# Altium project Wireless_Security_Detector.PrjPcb
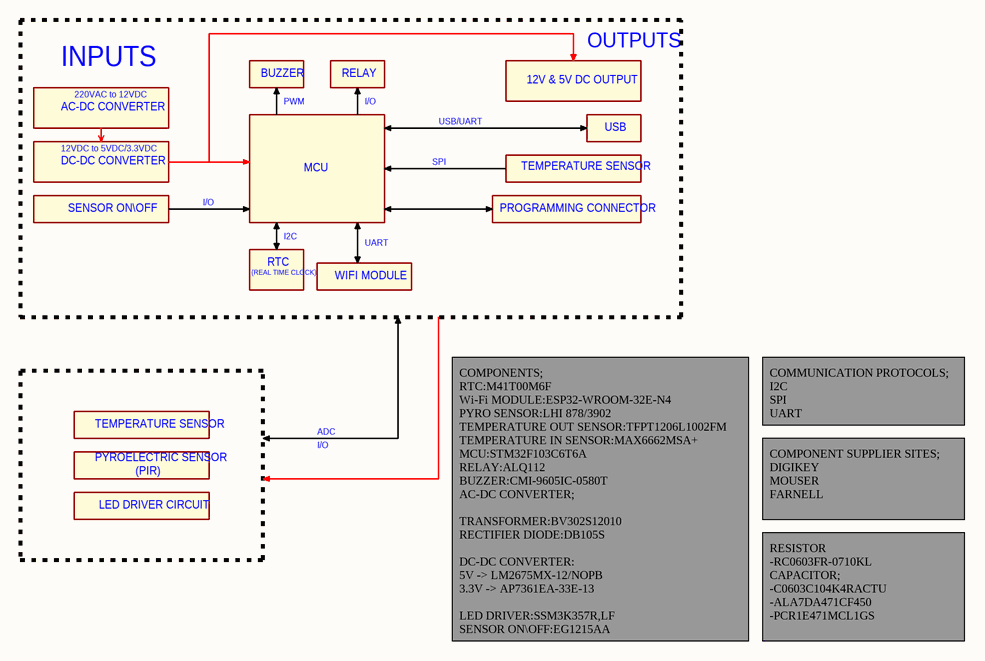
[diagram p0: Block_Diagram.SchDoc]
5 sheets, 126 parts. Net scope: global (net labels, ports and power ports of the same name join across sheets).
Board file: Wireless_Security_Detector.PcbDoc
Sheets:
  Wireless_Security_Detector.SchDoc
  Block_Diagram.SchDoc
  Power_Management.SchDoc
  Microcontroller.SchDoc
  Sensor_Board.SchDoc

## Sheet Wireless_Security_Detector.SchDoc
size A3; Date: 29/01/2025; Engineer: Emirhan BOZKURT; SheetNumber: 1; SheetTotal: 5; PageSize: A3; Position: R&D Electronics Engineer

### Notes on the sheet
- Document Name:
- Designed By:
- Department:
- Project Name:
- Sheet Number:
- Size:
- Date:

## Sheet Block_Diagram.SchDoc
size A3; Date: 29/01/2025; Engineer: Emirhan BOZKURT; SheetNumber: 2; SheetTotal: 5; PageSize: A3; Position: R&D Electronics Engineer

### Notes on the sheet
- INPUTS
- BUZZER
- RELAY
- OUTPUTS
- AC-DC CONVERTER
- 12VDC to 5VDC/3.3VDC
- 220VAC to 12VDC
- PWM
- I/O
- USB/UART
- 12V & 5V DC OUTPUT
- USB
- DC-DC CONVERTER
- SENSOR ON\OFF
- MCU
- SPI
- PROGRAMMING CONNECTOR
- TEMPERATURE SENSOR
- (REAL TIME CLOCK)
- RTC
- I2C
- WIFI MODULE
- UART
- COMMUNICATION PROTOCOLS;
  I2C
  SPI
  UART
- PYROELECTRIC SENSOR
- (PIR)
- ADC
- LED DRIVER CIRCUIT
- COMPONENT SUPPLIER SITES;
  DIGIKEY
  MOUSER
  FARNELL
- COMPONENTS;
  RTC:M41T00M6F
  Wi-Fi MODULE:ESP32-WROOM-32E-N4
  PYRO SENSOR:LHI 878/3902
  TEMPERATURE OUT SENSOR:TFPT1206L1002FM
  TEMPERATURE IN SENSOR:MAX6662MSA+
  MCU:STM32F103C6T6A
  RELAY:ALQ112
  BUZZER:CMI-9605IC-0580T
  AC-DC CONVERTER;
  TRANSFORMER:BV302S12010
  RECTIFIER DIODE:DB105S
  DC-DC CONVERTER:
  5V -> LM2675MX-12/NOPB
  3.3V -> AP7361EA-33E-13
  LED DRIVER:SSM3K357R,LF
  SENSOR ON\OFF:EG1215AA
- RESISTOR
  -RC0603FR-0710KL
  CAPACITOR;
  -C0603C104K4RACTU
  -ALA7DA471CF450
  -PCR1E471MCL1GS
- Document Name:
- Designed By:
- Department:
- Project Name:
- Sheet Number:
- Size:
- Date:

## Sheet Power_Management.SchDoc
size A3; Date: 29/01/2025; Engineer: Emirhan BOZKURT; SheetNumber: 3; SheetTotal: 5; PageSize: A3; Position: R&D Electronics Engineer
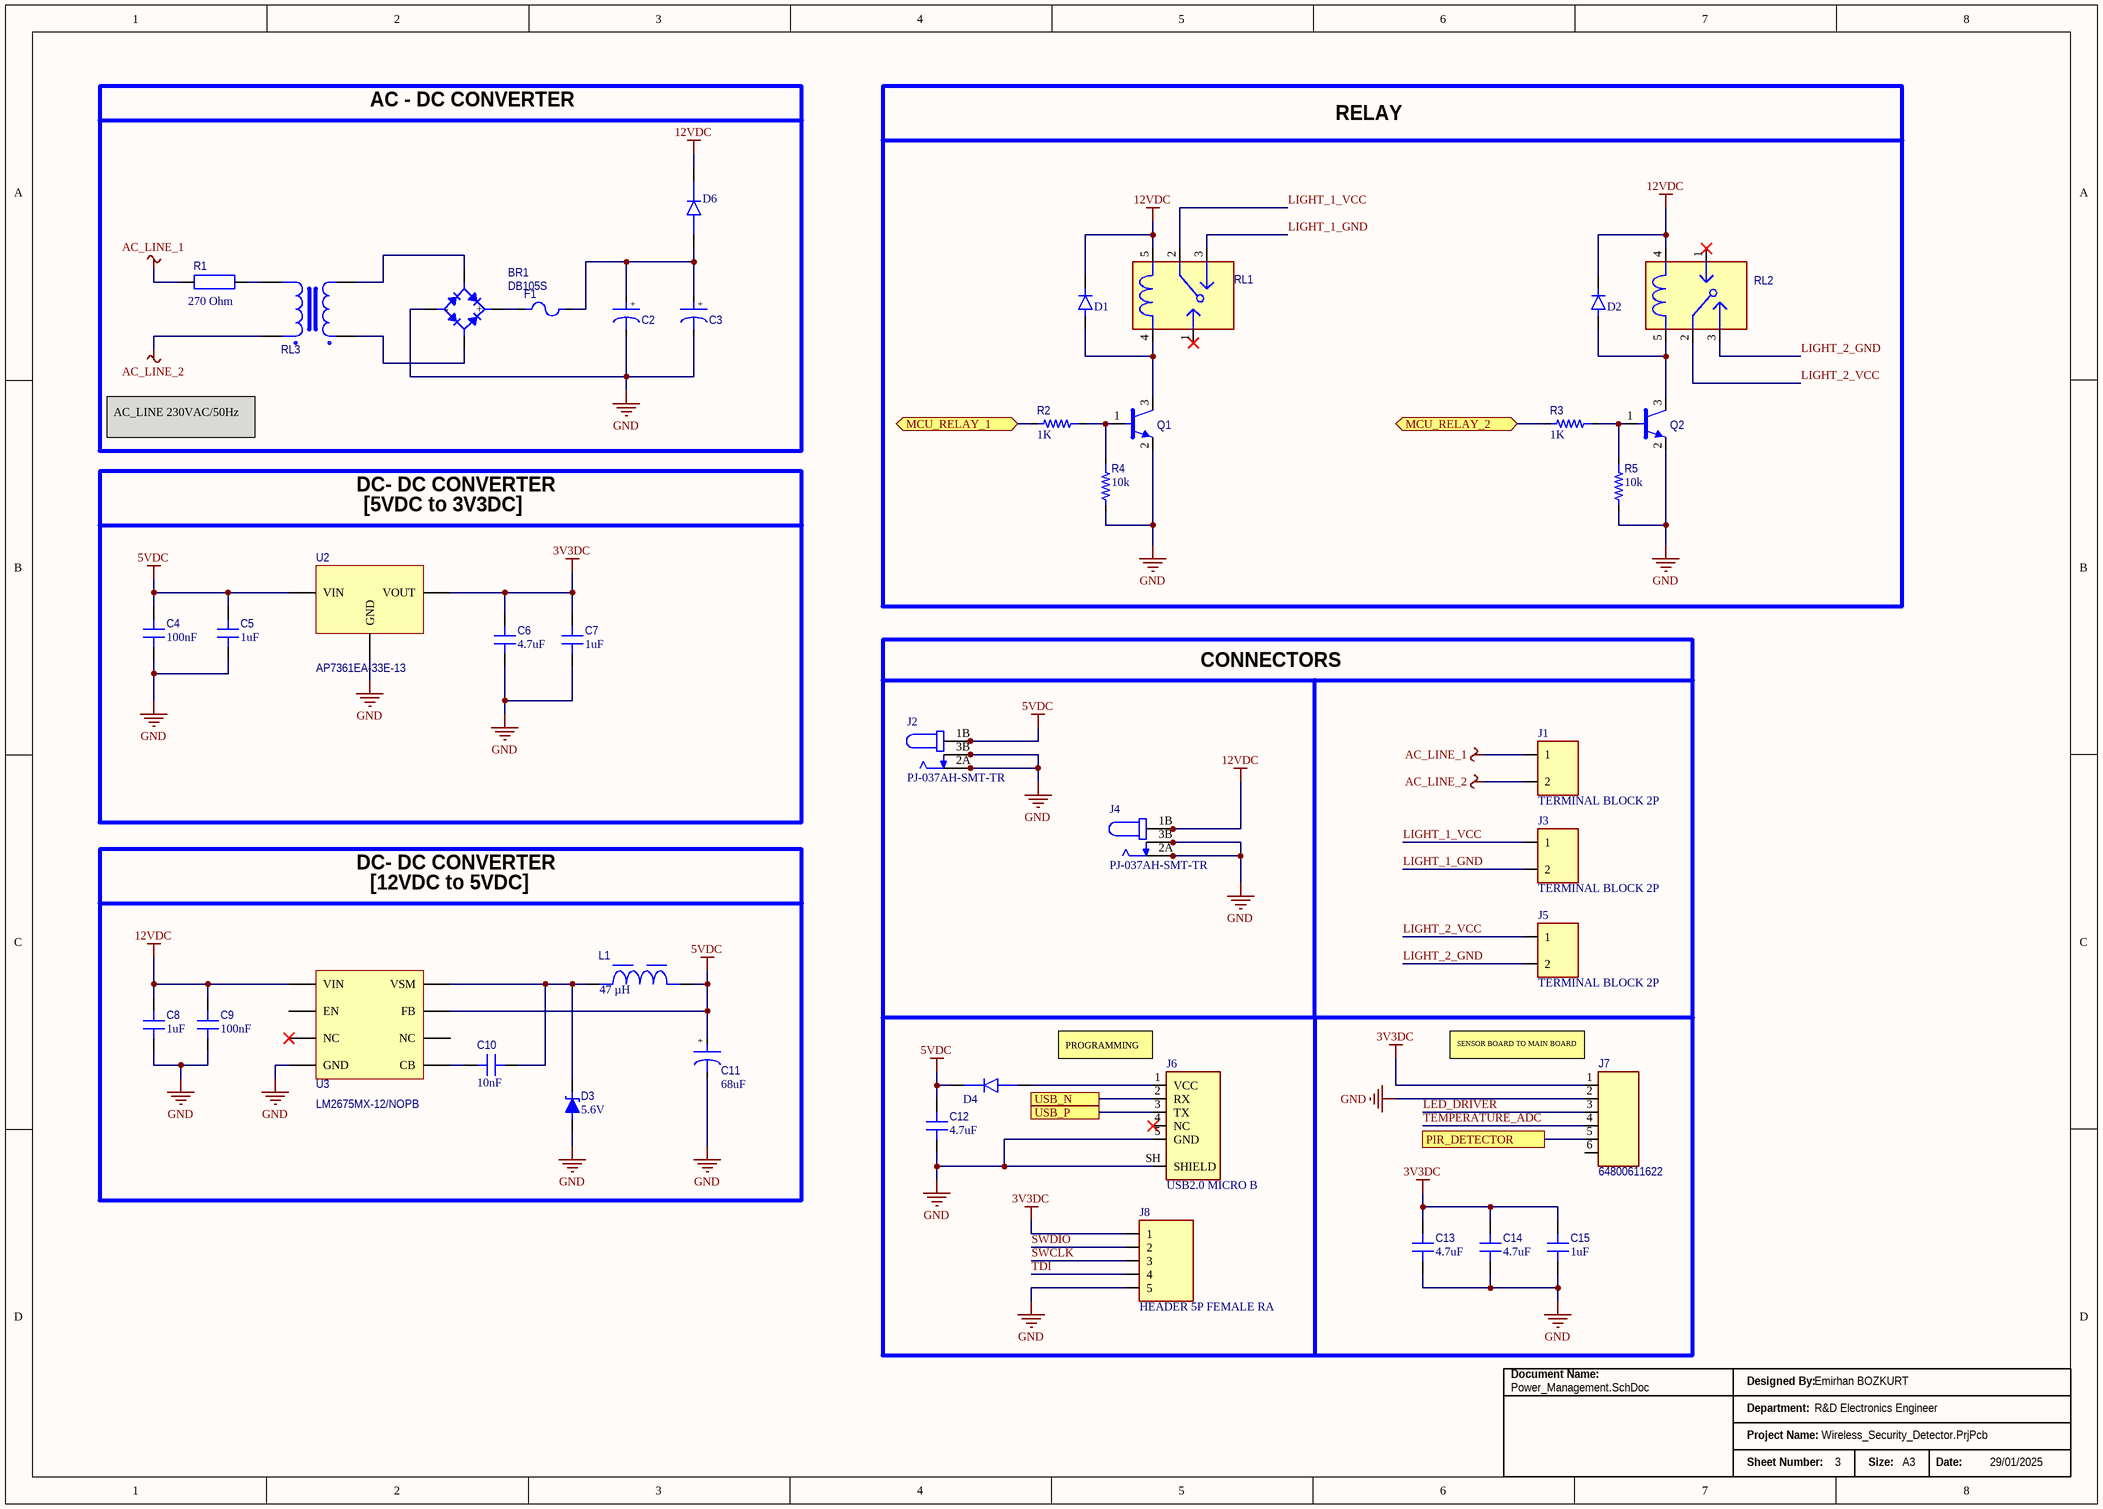
[diagram p1: Power_Management.SchDoc]

### Parts
BR1  DB105S  [DB105S]
C2  ESH477M035AH3AA  [ESH477M035AH3AA]  (value not drawn)
C3  ESH477M035AH3AA  [ESH477M035AH3AA]  (value not drawn)
C4  value 100nF  [CAP_0805]  (hidden comment: 1276-1003-2-ND)
C5  value 1uF  [CAP_0805]  (hidden comment: CL21B105KBFNNNE)
C6  value 4.7uF  [CAP_0805]  (hidden comment: CL21A475KAQNNNE)
C7  value 1uF  [CAP_0805]  (hidden comment: CL21B105KBFNNNE)
C8  value 1uF  [CAP_0805]  (hidden comment: CL21B105KBFNNNE)
C9  value 100nF  [CAP_0805]  (hidden comment: 1276-1003-2-ND)
C10  value 10nF  [CAP_0603]  (hidden comment: CL10B102KB8NNNC)
C11  value 68uF  [CAP_ALU_68uF]  (hidden comment: EEV686M035A9HAA)
C12  value 4.7uF  [CAP_0805]  (hidden comment: CL21A475KAQNNNE)
C13  value 4.7uF  [CAP_0805]  (hidden comment: CL21A475KAQNNNE)
C14  value 4.7uF  [CAP_0805]  (hidden comment: CL21A475KAQNNNE)
C15  value 1uF  [CAP_0805]  (hidden comment: CL21B105KBFNNNE)
D1  1N4148WS  [1N4148WS]  (value not drawn)
D2  1N4148WS  [1N4148WS]  (value not drawn)
D3  value 5.6V  [1SMB5919BT3G]  (hidden comment: 1SMB5919BT3G)
D4  1N4148WS  [1N4148WS]  (value not drawn)
D6  1N4148WS  [1N4148WS]  (value not drawn)
F1  3413.0216.22  [FUSE 1A]  (value not drawn)
J1  TERMINAL BLOCK 2P  [TBP01R1-508]
J2  PJ-037AH-SMT-TR  [PJ-037AH-SMT-TR]
J3  TERMINAL BLOCK 2P  [TBP01R1-508]
J4  PJ-037AH-SMT-TR  [PJ-037AH-SMT-TR]
J5  TERMINAL BLOCK 2P  [TBP01R1-508]
J6  USB2.0 MICRO B  [USB2.0 MICRO B]
J7  64800611622  [64800611622]
J8  HEADER 5P FEMALE RA  [HDR_5_POS_CONN_RA]
L1  value 47 µH  [INT_47uL]  (hidden comment: 78438335470)
Q1  MMBT3904-7-F  [SOT-23F]  (value not drawn)
Q2  MMBT3904-7-F  [SOT-23F]  (value not drawn)
R1  value 270 Ohm  [RES_AXIAL_W]  (hidden comment: 5WD27)
R2  value 1K  [RES_0603]  (hidden comment: RC0603FR-071KL)
R3  value 1K  [RES_0603]  (hidden comment: RC0603FR-071KL)
R4  value 10k  [RES_0603]  (hidden comment: RC0603FR-0710KL)
R5  value 10k  [RES_0603]  (hidden comment: RC0603FR-0710KL)
RL1  ALQ112  [ALQ112]  (value not drawn)
RL2  ALQ112  [ALQ112]  (value not drawn)
RL3  BV302S12010  [BV302S12010]  (value not drawn)
U2  AP7361EA-33E-13  [AP7361EA-33E-13]
U3  LM2675MX-12/NOPB  [LM2675MX-12/NOPB]

### Blocks framed on the sheet
AC - DC CONVERTER: BR1 C2 C3 D6 F1 R1 RL3
RELAY: D1 D2 Q1 Q2 R2-R5 RL1 RL2
CONNECTORS: C12-C15 D4 J1-J8

### Ports
MCU_RELAY_1 (bidir), MCU_RELAY_2 (bidir), PIR_DETECTOR, USB_N, USB_P

### Nets
3V3DC: C6.2 C7.2 C13.2 C14.2 C15.2 J7.1 J8.1 U2.3(VOUT)
5VDC: C4.2 C5.2 C11.1(A) C12.2 D4.C J2.1A J2.1B L1.2 U2.1(VIN) U3.4(FB)
12VDC: C8.2 C9.2 D1.C D2.C D6.C J4.1A J4.1B RL1.5 RL2.4 U3.7(VIN)
AC_LINE_1: J1.1 R1.1
AC_LINE_2: J1.2 RL3.1
GND: BR1.4(-) C2.2(K) C3.2(K) C4.1 C5.1 C6.1 C7.1 C8.1 C9.1 C11.2(K) C12.1 C13.1 C14.1 C15.1 D3.1 J2.2A J2.2B J2.3A J2.3B J4.2A J4.2B J4.3A J4.3B J6.5(GND) J6.SH(SHIELD) J7.2 J8.5 Q1.2(E) Q2.2(E) R4.1 R5.1 U2.2(GND) U3.6(GND)
LED_DRIVER: J7.3
LIGHT_1_GND: J3.2 RL1.3(NO)
LIGHT_1_VCC: J3.1 RL1.2(NC)
LIGHT_2_GND: J5.2 RL2.3(NO)
LIGHT_2_VCC: J5.1 RL2.2(NC)
SWCLK: J8.3
SWDIO: J8.2
TDI: J8.4
TEMPERATURE_ADC: J7.4
USB_N: J6.2(RX) ; port USB_N
USB_P: J6.3(TX) ; port USB_P
NetBR1_1: BR1.1 RL3.9
NetBR1_2: BR1.2 RL3.7
NetBR1_3: BR1.3(+) F1.1
NetC2_1: C2.1(A) C3.1(A) D6.A F1.2
NetC10_1: C10.1 U3.1(CB)
NetC10_2: C10.2 D3.2 L1.1 U3.8(VSM)
NetD1_A: D1.A Q1.3(C) RL1.4
NetD2_A: D2.A Q2.3(C) RL2.5
NetD4_A: D4.A J6.1(VCC)
NetJ7_5: J7.5 ; port PIR_DETECTOR
NetQ1_1: Q1.1(B) R2.2 R4.2
NetQ2_1: Q2.1(B) R3.2 R5.2
NetR1_2: R1.2 RL3.5
NetR2_1: R2.1 ; port MCU_RELAY_1
NetR3_1: R3.1 ; port MCU_RELAY_2

Not connected (* = marked no-connect by the designer): J6 4(NC)*; J7 6; RL1 1(COM)*; RL2 1(COM)*; U3 2(NC)* 3(NC) 5(EN)

### Notes on the sheet
- AC_LINE 230VAC/50Hz
- DC- DC CONVERTER
- [5VDC to 3V3DC]
- 5VDC OUTPUT
- AC INPUT CONNECTOR
- 12VDC OUTPUT
- [12VDC to 5VDC]
- (near J3) LED 1 OUTPUT
- (near J5) LED 2 OUTPUT
- PROGRAMMING
- (near J7) SENSOR BOARD TO MAIN BOARD
- Document Name:
- Designed By:
- Department:
- Project Name:
- Sheet Number:
- Size:
- Date:
- (in symbol CAP ALU 68uF SMD) +
- (in symbol CAP ALU 470uF TH) +

### Library data of the parts
BR1 = DB105S: BRIDGE RECT 1PHASE 600V 1A DB-S; Designed By: Emirhan Bozkurt; Supplier Part Number: 1655-DB105STR-ND; Supplier 1: DigiKey; Max Supply Voltage: 600V; Current: 1A; Mounting Type: Surface Mount; Case Package: DB-S
C2 C3 = CAP ALU 470uF TH: CAP ALUM 470UF 20% 35V RADIAL TH; Manufacturer: KEMET; Manufacturer Product Number: ALA7DA471CF450; Designed By: Emirhan Bozkurt; Value: 470uF; Supplier Part Number: 399-6592-ND; Supplier 1: DigiKey; Category: Aluminum Electrolytic Capacitors; Mounting Type: TH; Size: 10mm
C4 C9 = CAP CER 100nF 0805: CAP CER 0.1uF 50V X7R 0805; Designed By: Emirhan Bozkurt; Supplier Part Number: 1276-1003-2-ND; Supplier 1: DigiKey; Case Package: 0805; Mounting Type: Surface Mount; Manufacturer Product Number: 1276-1003-2-ND
C5 C7 C8 C15 = CAP CER 1uF 0805: CAP CER 1uF 25V X5R 0805; Manufacturer: Samsung Electro-Mechanics; Designed By: Emirhan Bozkurt; Supplier Part Number: 1276-1029-1-ND; Supplier 1: DigiKey; Case Package: 0805; Mounting Type: Surface Mount
  C15: Manufacturer Product Number: CL21B105KBFNNNE
C6 C12-C14 = CAP CER 4.7uF 0805: CAP CER 4.7uF 25V X5R 0805; Manufacturer: Samsung Electro-Mechanics; Designed By: Emirhan Bozkurt; Supplier Part Number: CL21A475KAQNNNE; Supplier 1: DigiKey; Case Package: 0805; Mounting Type: Surface Mount; Manufacturer Product Number: CL21A475KAQNNNE
C10 = CAP CER 10nF 0603: CAP CER 1000pF 50V X7R 0603; Manufacturer: Samsung Electro-Mechanics; Designed By: Emirhan Bozkurt; Supplier Part Number: 1276-1018-1-ND; Supplier 1: DigiKey; Case Package: 0603; Mounting Type: Surface Mount
C11 = CAP ALU 68uF SMD: CAP ALUM 68uF 20% 35V SMD; Manufacturer: KEMET; Designed By: Emirhan Bozkurt; Supplier Part Number: 399-6722-1-ND; Supplier 1: DigiKey; Case Package: 0603; Category: Aluminum Electrolytic Capacitors; Mounting Type: Surface Mount
D1 D2 D4 D6 = 1N4148WS: DIODE STANDARD 75V 150MA SOD323F; Manufacturer: Diotec Semiconductor; Designed By: Emirhan Bozkurt; Supplier 1: DigiKey; Case Package: SOD-323F Diotec; Value: *; Supplier Part Number: 1N4148WSFSTR-ND; Check_prices: https://www.snapeda.com/parts/1N4148WS/Diotec/view-part/?ref=eda; Manufacturer Product Number: 1N4148WS
D3 = 1SMB5919BT3G: DIODE ZENER 5.6V 3W SMB; Manufacturer: Onsemi; Supplier Part Number: 1SMB5919BT3GOSCT-ND; Supplier 1: DigiKey; Mounting Type: Surface Mount; Case Package: SMB
F1 = FUSE 1A: FUSE BRD MNT 1A 32VAC 63VDC 1206; Voltage DC: 63V; Designed By: Emirhan Bozkurt; Supplier Part Number: 486-1144-2-ND; Supplier 1: Digi Key; Mounting Type: Surface Mount; Current: 1A
J1 J3 J5 = TERMINAL BLOCK 2P: Designed By: Emirhan Bozkurt; Number of Positions: 2; Mounting Type: Surface Mount, Right Angle; Through Hole; Manufacturer Product Number: *
J2 J4 = PJ-037AH-SMT-TR_1: CONN PWR JACK 2X5.5MM SOLDER; Manufacturer: Same Sky; Designed By: Emirhan Bozkurt; Supply Voltage: 24VDC; Supplier 1: DigiKey; Supplier Part Number: PJ-037AH-SMT-TR; Mounting Type: Surface Mount, Right Angle; Through Hole; Manufacturer Product Number: PJ-037AH-SMT-TR
J6 = USB2.0 MICRO B: CONN RCPT USB2.0 MICRO B SMD R/A; Manufacturer: Amphenol ICC; Manufacturer Product Number: 10118192-0001LF; Designed By: Emirhan Bozkurt; Connector Type: USB - micro B; Supplier Part Number: 609-4613-2-ND; Mounting Type: Surface Mount, Right Angle; Supplier 1: DigiKey
J7 = 64800611622-CONN-6P: WR-WTB WIRE-TO-BOARD CONNECTORS; Manufacturer: WE; Manufacturer Product Number: 1SMB5919BT3G; Pitch: 1.5 mm; Number of Positions: 6; Designed By: Emirhan Bozkurt; Supplier Part Number: 732-64800611622-ND; Supplier 1: DigiKey; Contact Type: Male
J8 = HEADER 5P FEMALE RA: CONN RCPT 5POS 0.1 GOLD SMD R/A; Manufacturer: Samtec; Manufacturer Product Number: SMH-105-02-L-S; Number of Positions: 5; Supplier 1: DigiKey; Supplier Part Number: SMH-105-02-L-S; Package: None
L1 = INT 47uH: FIXED IND 47UH 390MA 2.3 OHM SMD; Supply  Part Number: 732-6947-2-ND; Manufacturer: Würth; Designed By: Emirhan Bozkurt; Supplier 1: DigiKey
Q1 Q2 = MMBT3904-7-F: TRANS NPN 40V 0.2A SOT-23-3; Parameter 1: Surface Mount; Supplier Part Number: MMBT3904-FDICT-ND; Supplier 1: DigiKey; ComponentLink1Description: Datasheet; ComponentLink1URL: https://www.digikey.com/en/products/detail/toshiba-semiconductor-and-storage/SSM3K357R-LF/8611159; FET Type: NPN; Voltage - Collector Emitter: 40V; Case Package: SOT-23-3
R1 = 5WD27: RES WIREWOUND 270 Ohm; Max Power: 5 W; Supplier Part Number: 5WD27; Supplier 1: NTE Electronics; Mounting Type: TH
R2 R3 = RES 1K 0603: RES 1K 1% 1/10W 0603; Suppier Part Number: 311-1.00KHRCT-ND; Manufacturer: YAGEO; Designed By: Emirhan Bozkurt; Supplier 1: DigiKey; Case Package: 0603; Mounting Type: Surface Mount; Category: Chip Resistor; Manufacturer Product Number: RC0603FR-071KL
R4 R5 = RES 10K 0603: RES 10K OHM 1% 1/10W 0603; Suppier Part Number: 311-10.0KHRTR-ND; Manufacturer: YAGEO; Designed By: Emirhan Bozkurt; Supplier 1: DigiKey; Case Package: 0603; Mounting Type: Surface Mount; Category: Chip Resistor; Manufacturer Product Number: RC0603FR-0710KL
RL1 RL2 = ALQ112: RELAY GEN PURPOSE SPDT 10A 12V; Max Switching Voltage: 250V AC - 30V DC; Designed By: Emirhan Bozkurt; Supplier Part Number: 255-3562-ND; Supplier 1: DigiKey; Current: 10A; Mounting Type: TH; Manufacturer Product Number: ALQ112
RL3 = BV302S12010: 230V - 12V PWR XFMR 1VA TH; Designed By: Emirhan Bozkurt; Supplier Part Number: PWR XFMR 1VA TH; Supplier 1: DigiKey; Primary Voltage: 230V; Secondary Voltage: 12V; Operating Frequency: *; Mounting Type: TH
U2 = AP7361EA-33E-13: LDO CMOS HICURR SOT223 T&R 2.5K; Designed By: Emirhan Bozkurt; Max Input Voltage: 6V; Output Voltage: 3.3V; Current: 1A; Supplier Part Number: 31-AP7361EA-33E-13TR-ND; Supplier 1: DigiKey; Mounting Type: Surface Mount; Case Package: SOT223; Manufacturer Product Number: AP7361EA-33E-13
U3 = LM2675MX-12/NOPB: IC REG BUCK 12V 1A SOIC-8; Designed By: Emirhan Bozkurt; Max Input Voltage: 40V; Min Input Voltage: 6.5V; Supplier Part Number: 296-35410-2-ND; Supplier 1: DigiKey; Current: 1A; Mounting Type: Surface Mount; Case Package: SOIC-8

## Sheet Microcontroller.SchDoc
size A3; Date: 29/01/2025; Engineer: Emirhan BOZKURT; SheetNumber: 4; SheetTotal: 5; PageSize: A3; Position: R&D Electronics Engineer
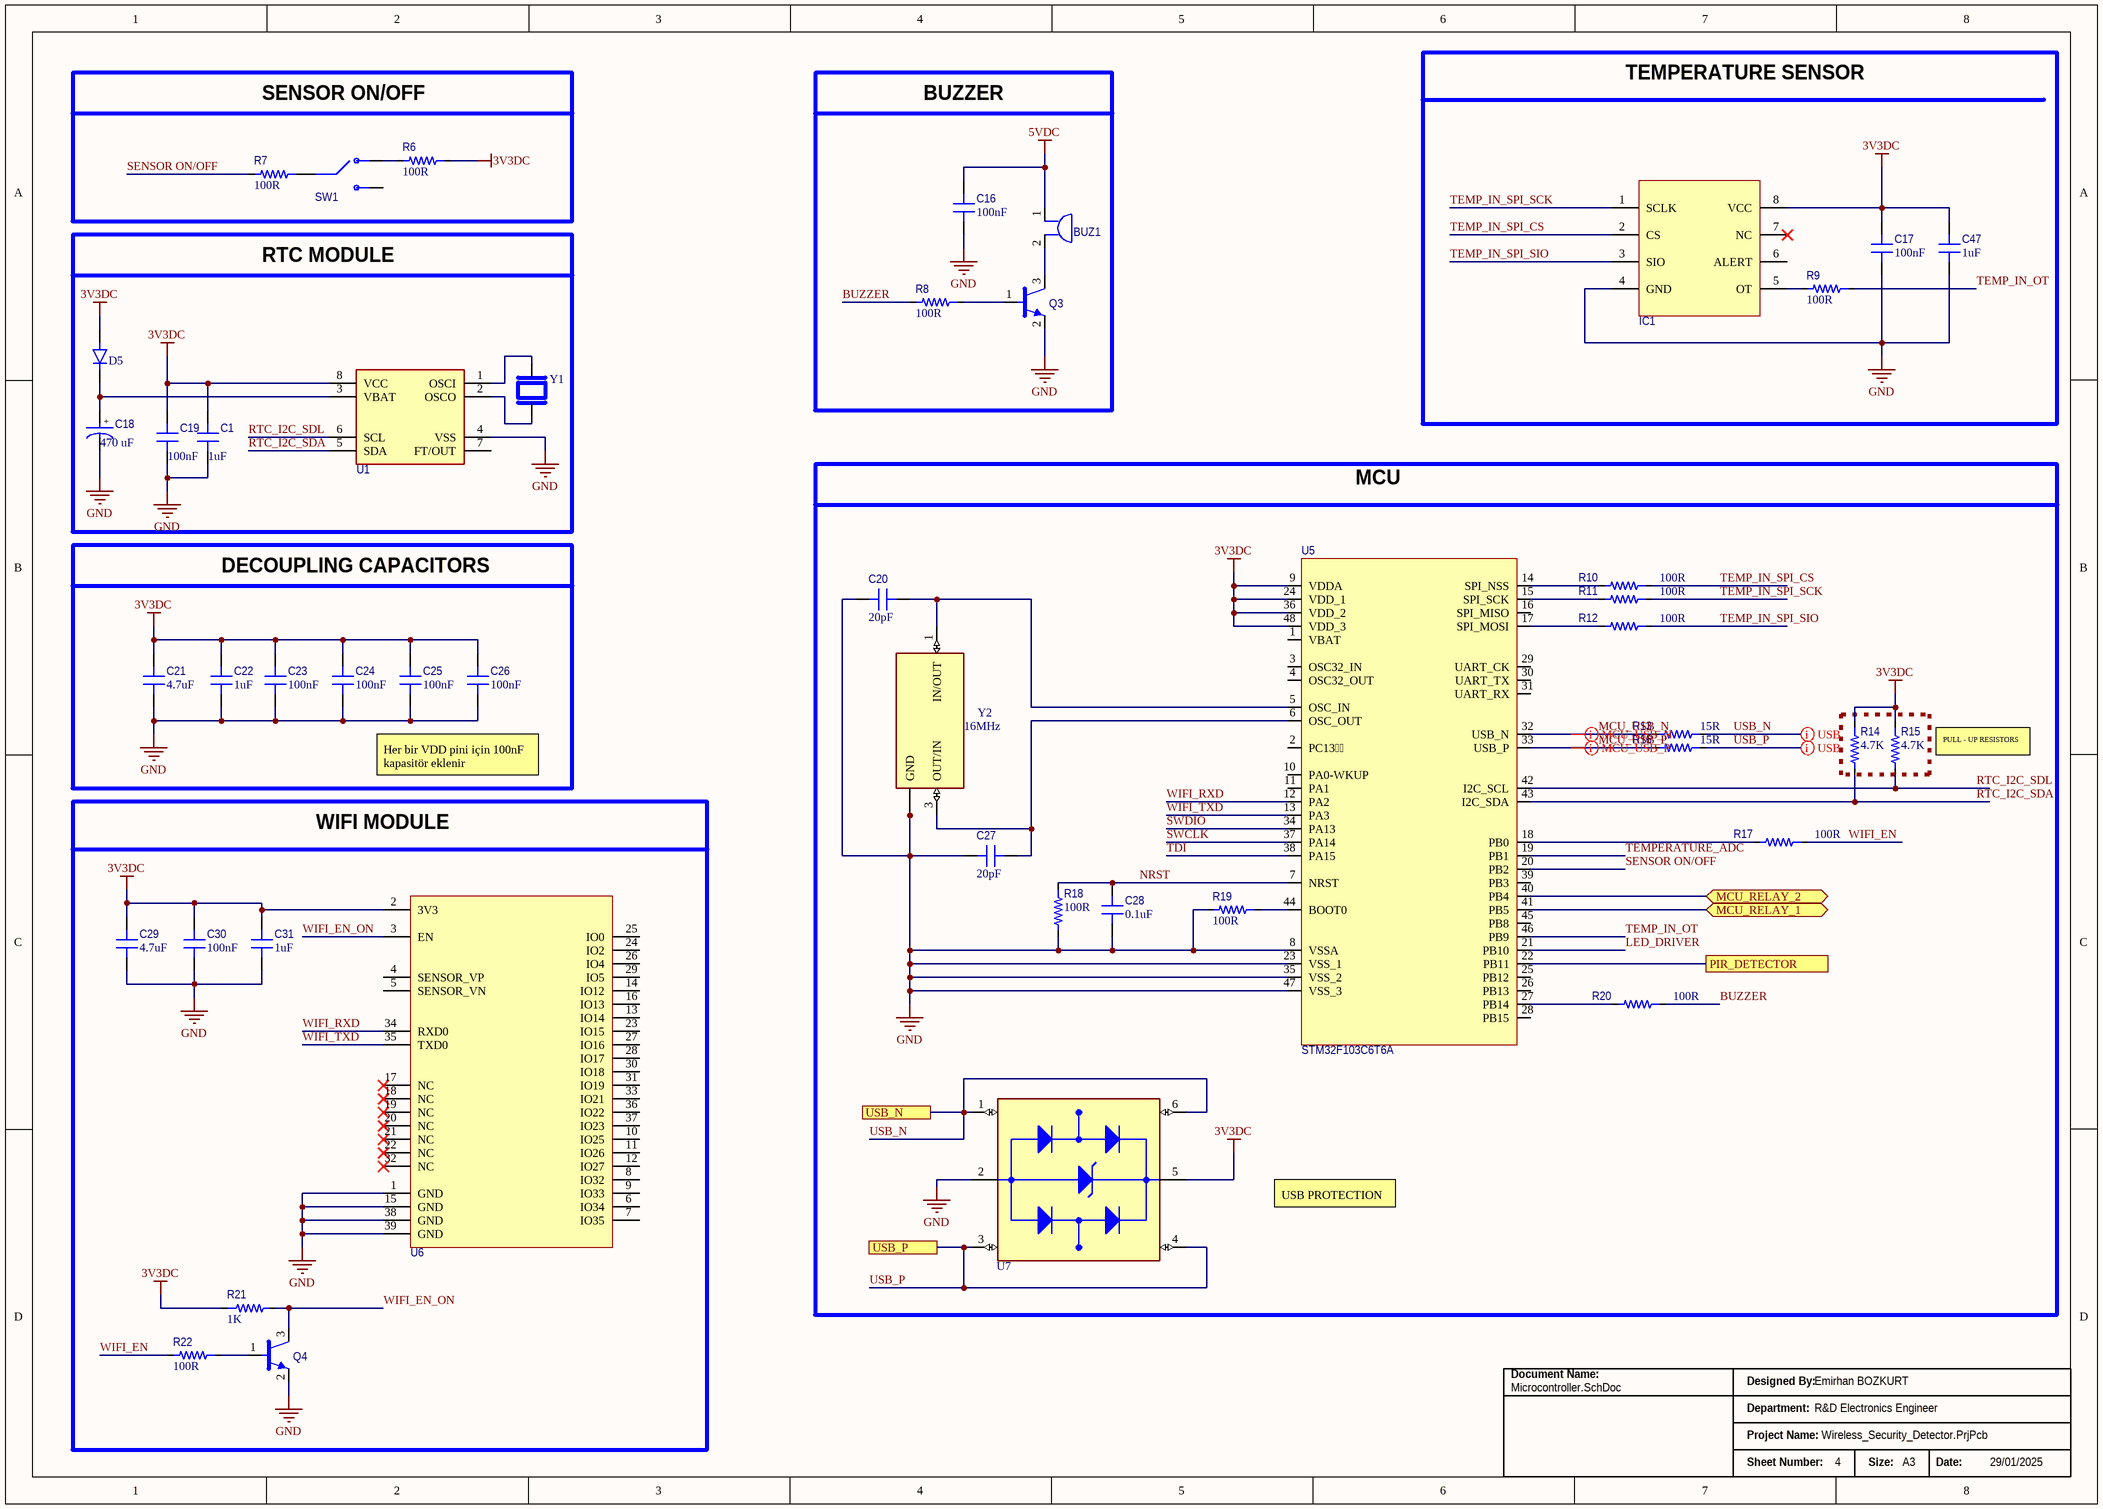
[diagram p2: Microcontroller.SchDoc]

### Parts
BUZ1  CMI-9605IC-0580T  [CMI-9605IC-0580T]  (value not drawn)
C1  value 1uF  [CAP_0805]  (hidden comment: CL21B105KBFNNNE)
C16  value 100nF  [CAP_0805]  (hidden comment: 1276-1003-2-ND)
C17  value 100nF  [CAP_0805]  (hidden comment: 1276-1003-2-ND)
C18  value 470 uF  [CAP_ALU_470UF_SMD]  (hidden comment: PCR1E471MCL1GS)
C19  value 100nF  [CAP_0805]  (hidden comment: 1276-1003-2-ND)
C20  value 20pF  [CAP_0603]  (hidden comment: C0603C104K4RACTU)
C21  value 4.7uF  [CAP_0805]  (hidden comment: CL21A475KAQNNNE)
C22  value 1uF  [CAP_0805]  (hidden comment: CL21B105KBFNNNE)
C23  value 100nF  [CAP_0805]  (hidden comment: 1276-1003-2-ND)
C24  value 100nF  [CAP_0805]  (hidden comment: 1276-1003-2-ND)
C25  value 100nF  [CAP_0805]  (hidden comment: 1276-1003-2-ND)
C26  value 100nF  [CAP_0805]  (hidden comment: 1276-1003-2-ND)
C27  value 20pF  [CAP_0603]  (hidden comment: C0603C104K4RACTU)
C28  value 0.1uF  [CAP_0603]  (hidden comment: C0603C104K4RACTU)
C29  value 4.7uF  [CAP_0805]  (hidden comment: CL21A475KAQNNNE)
C30  value 100nF  [CAP_0805]  (hidden comment: 1276-1003-2-ND)
C31  value 1uF  [CAP_0805]  (hidden comment: CL21B105KBFNNNE)
C47  value 1uF  [CAP_0805]  (hidden comment: CL21B105KBFNNNE)
D5  1N4148WS  [1N4148WS]  (value not drawn)
IC1  MAX6662MSA+  [SOIC-8]  (value not drawn)
Q3  MMBT3904-7-F  [SOT-23F]  (value not drawn)
Q4  MMBT3904-7-F  [SOT-23F]  (value not drawn)
R6  value 100R  [RES_0603]  (hidden comment: RC0603FR-07100RL)
R7  value 100R  [RES_0603]  (hidden comment: RC0603FR-07100RL)
R8  value 100R  [RES_0603]  (hidden comment: RC0603FR-07100RL)
R9  value 100R  [RES_0603]  (hidden comment: RC0603FR-07100RL)
R10  value 100R  [RES_0603]  (hidden comment: RC0603FR-07100RL)
R11  value 100R  [RES_0603]  (hidden comment: RC0603FR-07100RL)
R12  value 100R  [RES_0603]  (hidden comment: RC0603FR-07100RL)
R13  value 15R  [RES_0603]  (hidden comment: RC0603FR-0715RL)
R14  value 4.7K  [RES_0603]  (hidden comment: RC0603FR-074K7L)
R15  value 4.7K  [RES_0603]  (hidden comment: RC0603FR-074K7L)
R16  value 15R  [RES_0603]  (hidden comment: RC0603FR-0715RL)
R17  value 100R  [RES_0603]  (hidden comment: RC0603FR-07100RL)
R18  value 100R  [RES_0603]  (hidden comment: RC0603FR-07100RL)
R19  value 100R  [RES_0603]  (hidden comment: RC0603FR-07100RL)
R20  value 100R  [RES_0603]  (hidden comment: RC0603FR-07100RL)
R21  value 1K  [RES_0603]  (hidden comment: RC0603FR-071KL)
R22  value 100R  [RES_0603]  (hidden comment: RC0603FR-07100RL)
SW1  EG1215AA  [EG1215AA]  (value not drawn)
U1  M41T00M6F  [SOIC-8]  (value not drawn)
U5  STM32F103C6T6A  [LQFP-48]
U6  ESP32-WROOM-32E-N4  [ESP32-WROOM-32E]  (value not drawn)
U7  USBLC6-2SC6  [SOT95P280X145-6N]  (value not drawn)
Y1  ABS05-32.768KHZ-T  [XTAL_ABS05-32.768KHZ-T]  (value not drawn)
Y2  value 16MHz  [XTAL_ECS-160-20-30B-TR]  (hidden comment: ECS-160-20-30B-TR)

### Blocks framed on the sheet
TEMPERATURE SENSOR: C17 C47 IC1 R9
SENSOR ON/OFF: R6 R7 SW1
BUZZER: BUZ1 C16 Q3 R8
RTC MODULE: C1 C18 C19 D5 U1 Y1
MCU: C20 C27 C28 R10-R20 U5 U7 Y2
DECOUPLING CAPACITORS: C21-C26
WIFI MODULE: C29-C31 Q4 R21 R22 U6

### Ports
MCU_RELAY_1 (bidir), MCU_RELAY_2 (bidir), PIR_DETECTOR, USB_N, USB_P

### Nets
3V3DC: C1.2 C17.2 C19.2 C21.2 C22.2 C23.2 C24.2 C25.2 C26.2 C29.2 C30.2 C31.2 C47.2 D5.A IC1.8(VCC) R6.2 R14.2 R15.2 R21.2 U1.8(VCC) U5.9(VDDA) U5.24(VDD_1) U5.36(VDD_2) U5.48(VDD_3) U6.2(3V3) U7.5(VBUS)
5VDC: BUZ1.1 C16.2
GND: C1.1 C16.1 C17.1 C18.2 C19.1 C20.1 C21.1 C22.1 C23.1 C24.1 C25.1 C26.1 C27.1 C28.1 C29.1 C30.1 C31.1 C47.1 IC1.4(GND) Q3.2(E) Q4.2(E) R18.1 R19.1 U1.4(VSS) U5.8(VSSA) U5.23(VSS_1) U5.35(VSS_2) U5.47(VSS_3) U6.1(GND) U6.15(GND) U6.38(GND) U6.39(GND) U7.2(GND) Y2.2(GND) Y2.4(GND)
BUZZER: R8.1 R20.2
LED_DRIVER: U5.21(PB10)
MCU_USB_N: R13.1 U5.32(USB_N)
MCU_USB_P: R16.1 U5.33(USB_P)
NRST: C28.2 R18.2 U5.7(NRST)
RTC_I2C_SDA: R14.1 U1.5(SDA) U5.43(I2C_SDA)
RTC_I2C_SDL: R15.1 U1.6(SCL) U5.42(I2C_SCL)
SENSOR ON/OFF: R7.1 U5.20(PB2)
SWCLK: U5.37(PA14)
SWDIO: U5.34(PA13)
TDI: U5.38(PA15)
TEMP_IN_OT: R9.2 U5.46(PB9)
TEMP_IN_SPI_CS: IC1.2(CS) R10.2
TEMP_IN_SPI_SCK: IC1.1(SCLK) R11.2
TEMP_IN_SPI_SIO: IC1.3(SIO) R12.2
TEMPERATURE_ADC: U5.19(PB1)
USB_N: R13.2 U7.1(I/O1_IN) U7.6(I/O1_OUT) ; port USB_N
USB_P: R16.2 U7.3(I/O2_IN) U7.4(I/O2_OUT) ; port USB_P
WIFI_EN: R17.2 R22.1
WIFI_EN_ON: Q4.3(C) R21.1 U6.3(EN)
WIFI_RXD: U5.12(PA2) U6.34(RXD0)
WIFI_TXD: U5.13(PA3) U6.35(TXD0)
NetBUZ1_2: BUZ1.2 Q3.3(C)
NetC18_1: C18.1 D5.C U1.3(VBAT)
NetC20_2: C20.2 U5.5(OSC_IN) Y2.1(IN/OUT)
NetC27_2: C27.2 U5.6(OSC_OUT) Y2.3(OUT/IN)
NetIC1_5: IC1.5(OT) R9.1
NetJ7_5: U5.22(PB11) ; port PIR_DETECTOR
NetQ3_1: Q3.1(B) R8.2
NetQ4_1: Q4.1(B) R22.2
NetR2_1: U5.41(PB5) ; port MCU_RELAY_1
NetR3_1: U5.40(PB4) ; port MCU_RELAY_2
NetR6_1: R6.1 SW1.1
NetR7_2: R7.2 SW1.2
NetR10_1: R10.1 U5.14(SPI_NSS)
NetR11_1: R11.1 U5.15(SPI_SCK)
NetR12_1: R12.1 U5.17(SPI_MOSI)
NetR17_1: R17.1 U5.18(PB0)
NetR19_2: R19.2 U5.44(BOOT0)
NetR20_1: R20.1 U5.27(PB14)
NetU1_1: U1.1(OSCI) Y1.2
NetU1_2: U1.2(OSCO) Y1.1

Not connected (* = marked no-connect by the designer): IC1 6(ALERT) 7(NC)*; SW1 3; U1 7(FT/OUT); U5 1(VBAT) 2(PC13) 3(OSC32_IN) 4(OSC32_OUT) 10(PA0-WKUP) 11(PA1) 16(SPI_MISO) 25(PB12) 26(PB13) 28(PB15) 29(UART_CK) 30(UART_TX) 31(UART_RX) 39(PB3) 45(PB8); U6 4(SENSOR_VP) 5(SENSOR_VN) 6(IO34) 7(IO35) 8(IO32) 9(IO33) 10(IO25) 11(IO26) 12(IO27) 13(IO14) 14(IO12) 16(IO13) 17(NC)* 18(NC)* 19(NC)* 20(NC)* 21(NC)* 22(NC)* 23(IO15) 24(IO2) 25(IO0) 26(IO4) 27(IO16) 28(IO17) 29(IO5) 30(IO18) 31(IO19) 32(NC)* 33(IO21) 36(IO22) 37(IO23)

### Layout directives
differential pair: MCU_USB_N, MCU_USB_P, USB_N, USB_P

### Notes on the sheet
- Her bir VDD pini için 100nF kapasitör eklenir
- (near R15) PULL - UP RESISTORS
- USB PROTECTION
- Document Name:
- Designed By:
- Department:
- Project Name:
- Sheet Number:
- Size:
- Date:
- (in symbol CAP ALU 470uF SMD) +

### Library data of the parts
BUZ1 = CMI-9605IC-0580T: BUZZER MAGNETIC 5V 9.6MM TH; Max Supply Voltage: 7V; Min Supply Voltage: 3V; Designed By: Emirhan Bozkurt; Supplier Part Number: 2223-CMI-9605IC-0580T-ND; Supplier 1: DigiKey; Mounting Type: TH; Size: 9.6mm; Case Package: CMI-9605IC; Manufacturer Product Number: CMI-9605IC-0580T
C1 C22 C31 C47 = CAP CER 1uF 0805: as C5 on sheet Power_Management; Supplier Part Number: 1276-1029-1-ND; Supplier 1: DigiKey; Case Package: 0805; Mounting Type: Surface Mount; Manufacturer Product Number: CL21B105KBFNNNE
C16 C17 C19 C23-C26 C30 = CAP CER 100nF 0805: as C4 on sheet Power_Management; Supplier Part Number: 1276-1003-2-ND; Supplier 1: DigiKey; Case Package: 0805; Mounting Type: Surface Mount; Manufacturer Product Number: 1276-1003-2-ND
C18 = CAP ALU 470uF SMD: CAP ALUM POLY 470uF 20% 25V SMD; Manufacturer: Nichicon; Designed By: Emirhan Bozkurt; Parameter 1: DigiKey; Supplier Part Number: 493-13756-2-ND; Supplier 1: Digi Key; Mounting Type: Surface Mount; Supply Voltage: 25V; Category: Aluminum - Polymer Capacitors; Manufacturer Product Number: PCR1E471MCL1GS
C20 C27 = CAP CER 20pF 0603: CAP CER 20pF 50V C0G/NP0 0603; Manufacturer: Samsung Electro-Mechanics; Designed By: Emirhan Bozkurt; Supplier Part Number: 1276-1187-2-ND; Supplier 1: DigiKey; Case Package: 0603; Mounting Type: Surface Mount; Manufacturer Product Number: C0603C104K4RACTU
C21 C29 = CAP CER 4.7uF 0805: as C6 on sheet Power_Management; Supplier Part Number: CL21A475KAQNNNE; Supplier 1: DigiKey; Case Package: 0805; Mounting Type: Surface Mount; Manufacturer Product Number: CL21A475KAQNNNE
C28 = CAP CER 0.1uF 0603: CAP CER 0.1uF 16V X7R 0603; Manufacturer: Samsung Electro-Mechanics; Designed By: Emirhan Bozkurt; Supplier Part Number: 399-C0603C104K4RACTUTR-ND; Supplier 1: DigiKey; Case Package: 0603; Mounting Type: Surface Mount; Manufacturer Product Number: C0603C104K4RACTU
D5 = 1N4148WS: as D1 on sheet Power_Management; Supplier 1: DigiKey; Case Package: SOD-323F Diotec; Value: *; Supplier Part Number: 1N4148WSFSTR-ND; Check_prices: https://www.snapeda.com/parts/1N4148WS/Diotec/view-part/?ref=eda; Manufacturer Product Number: 1N4148WS
IC1 = MAX6662MSA+: TEMPERATURE SENSOR DIGITAL REMOTE 8SOIC; Designed By: Emirhan Bozkurt; Supplier Part Number: MAX6662MSA+-ND; Supplier 1: DigiKey; Max Operating Temperature: +150; Min Operating Temperature: -55; Case Package: SOIC-8; Manufacturer Product Number: MAX6662MSA+
Q3 Q4 = MMBT3904-7-F: as Q1 on sheet Power_Management; Supplier Part Number: MMBT3904-FDICT-ND; Supplier 1: DigiKey; ComponentLink1Description: Datasheet; ComponentLink1URL: https://www.digikey.com/en/products/detail/toshiba-semiconductor-and-storage/SSM3K357R-LF/8611159; FET Type: NPN; Voltage - Collector Emitter: 40V; Case Package: SOT-23-3; Manufacturer Product Number: MMBT3904-7-F
R6-R12 R17-R20 R22 = RES 100R 0603: RES 100 OHM 1% 1/10W 0603; Suppier Part Number: 311-100HRTR-ND; Manufacturer: YAGEO; Designed By: Emirhan Bozkurt; Supplier 1: DigiKey; Case Package: 0603; Mounting Type: Surface Mount; Category: Chip Resistor; Manufacturer Product Number: RC0603FR-07100RL
R13 R16 = RES 15R 0603: RES 15 OHM 1% 1/10W 0603; Suppier Part Number: 311-15.0HRTR-ND; Manufacturer: YAGEO; Designed By: Emirhan Bozkurt; Supplier 1: DigiKey; Case Package: 0603; Mounting Type: Surface Mount; Category: Chip Resistor; Manufacturer Product Number: RC0603FR-0715RL
R14 R15 = RES 4K7 0603: RES 4K7 OHM 1% 1/10W 0603; Suppier Part Number: 311-4.70KHRCT-ND; Manufacturer: YAGEO; Designed By: Emirhan Bozkurt; Supplier 1: DigiKey; Case Package: 0603; Mounting Type: Surface Mount; Category: Chip Resistor; Manufacturer Product Number: RC0603FR-074K7L
R21 = RES 1K 0603: as R2 on sheet Power_Management; Supplier 1: DigiKey; Case Package: 0603; Mounting Type: Surface Mount; Category: Chip Resistor; Manufacturer Product Number: RC0603FR-071KL
SW1 = EG1215AA: SWITCH SLIDE SPDT 25MA 24V; Designed By: Emirhan Bozkurt; Supplier Part Number: EG5720TR-ND; Supplier 1: DigiKey; Max Supply Voltage: 24V; Current: 25mA; Mounting Type: Surface Mount; Manufacturer Product Number: EG1215AA
U1 = M41T00M6F: IC RTC CLK/CALENDAR I2C 8SOIC; Voltage - Supply: 2V ~ 5.5V; Current: 70µA; Designed By: Emirhan BOZKURT; Supplier Part Number: 497-4697-2-ND; Package/Case: 8-SOIC; Mounting Type: Surface Mount; Supplier 1: DigiKey; Case Package: SOIC-8; Manufacturer Product Number: M41T00M6F
U5 = STM32F103C6T6A: IC MCU 32BIT 32KB FLASH 48LQFP; Voltage: 2V ~ 3.6V; Designed By: Emirhan Bozkurt; Supplier Part Number: 497-11515-ND; Supplier 1: DigiKey; Case Package: 48-LQFP; Mounting Type: Surface Mount; ComponentLink1Description: Datasheet; ComponentLink1URL: https://www.st.com/content/ccc/resource/technical/document/datasheet/0d/93/e0/d7/77/bf/4c/54/CD00210843.pdf/files/CD00210843.pdf/jcr:content/translations/en.CD00210843.pdf; Manufacturer Product Number: STM32F103C6T6A
U6 = ESP32-WROOM-32E-N4: RF TXRX MOD BT WIFI TH SMD; Supply Voltage Nominal: 3V3; Designed By: Emirhan Bozkurt; Frequency: 2.4GHz ~ 2.5GHz; Supplier Part Number: 1965-ESP32-WROOM-32E-N4TR-ND; Max Operating Temperature: 85 °C; Min Operating Temperature: -45 °C; ComponentLink1Description: Datasheet; ComponentLink1URL: https://www.espressif.com/sites/default/files/documentation/esp32-wroom-32e_esp32-wroom-32ue_datasheet_en.pdf; Supplier 1: DigiKey; Manufacturer Product Number: ESP32-WROOM-32E-N4
U7 = USB PROTECTION: TVS DIODE 5.25VWM 17VC SOT23-6; Manufacturer: STMicroelectronics; Designed By: Emirhan Bozkurt; Supplier 1: DigiKey; Case Package: SOT-23-6 STMicroelectronics; Supplier Part Number: 497-5235-2-ND; Manufacturer Product Number: USBLC6-2SC6
Y1 = ABS05-32.768KHZ-T: CRYSTAL 32.7680KHZ 12.5PF SMD; Suppler Part Number: 535-11899-2-ND; Designed By: Emirhan Bozkurt; Supplier 1: DigiKey; Mounting Type: Surface Mount; Series: ABS05; Value: 32.768 kHz; Manufacturer Product Number: ABS05-32.768KHZ-T
Y2 = ECS-160-20-30B-TR: CRYSTAL 16.0000MHZ 20PF SMD; Designed By: Emirhan Bozkurt; Supplier 1: DigiKey; Supplier Part Number: XC1120TR-ND; Series: ECX-53B; Manufacturer Product Number: ECS-160-20-30B-TR

## Sheet Sensor_Board.SchDoc
size A3; Engineer: Emirhan BOZKURT; SheetNumber: 5; SheetTotal: 5; PageSize: A3; Position: R&D Electronics Engineer
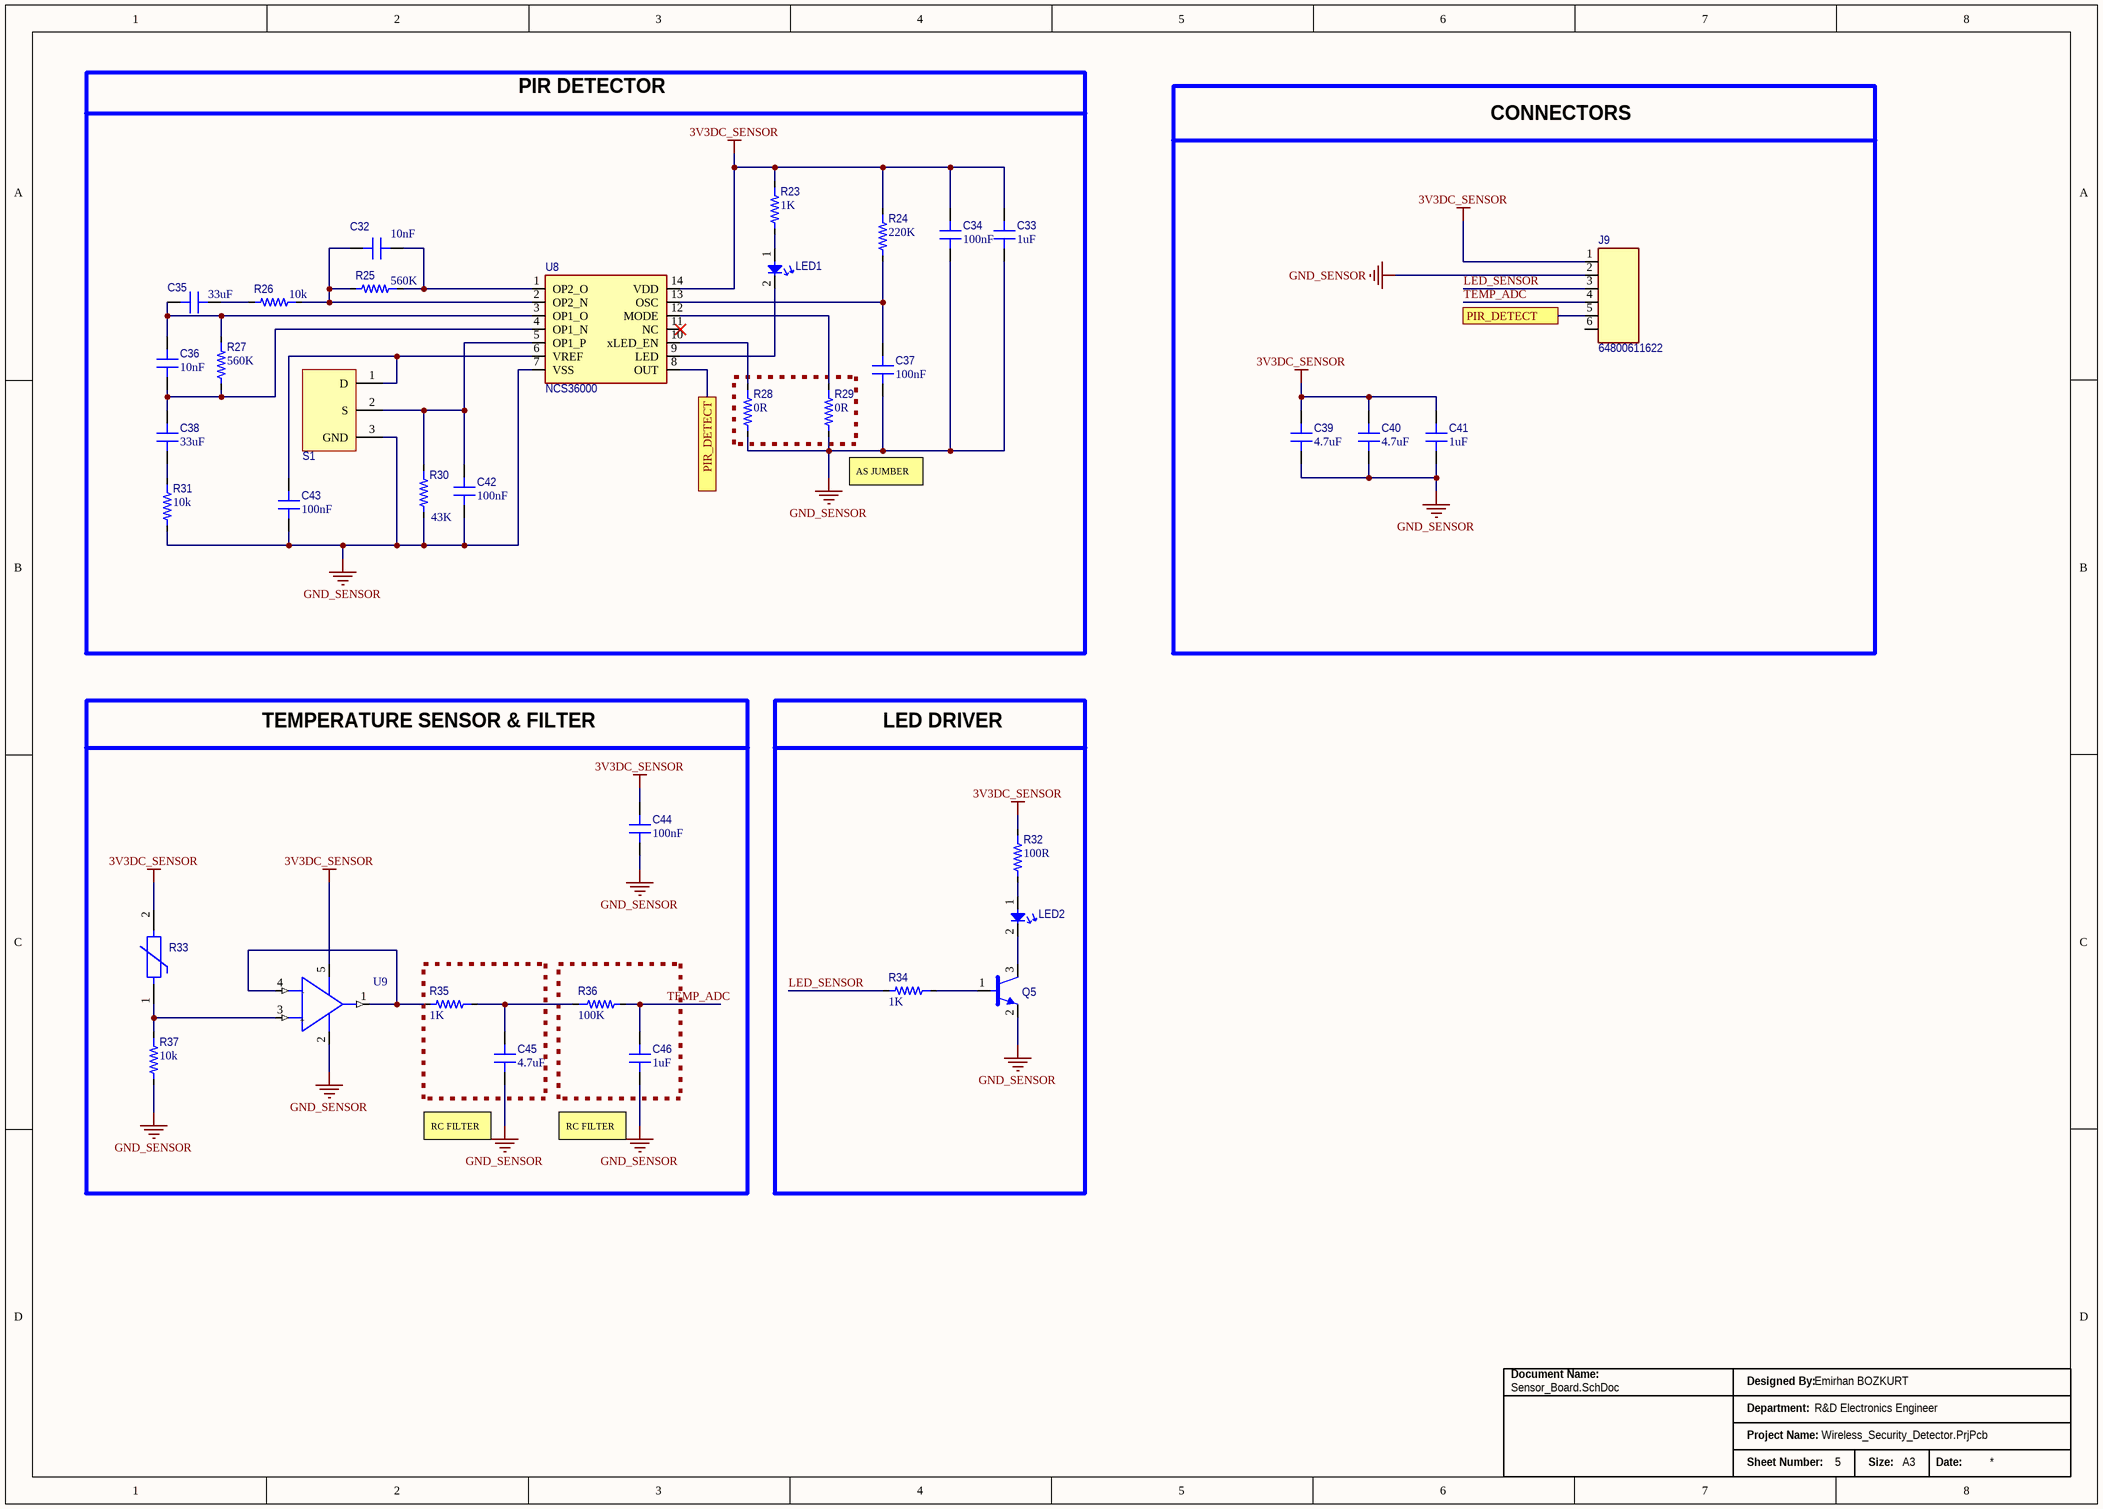
[diagram p3: Sensor_Board.SchDoc]

### Parts
C32  value 10nF  [CAP_0603]  (hidden comment: CL10B102KB8NNNC)
C33  value 1uF  [CAP_0805]  (hidden comment: CL21B105KBFNNNE)
C34  value 100nF  [CAP_0805]  (hidden comment: 1276-1003-2-ND)
C35  value 33uF  [CAP_0603]  (hidden comment: C3216X7S0J336M160AC)
C36  value 10nF  [CAP_0603]  (hidden comment: CL10B102KB8NNNC)
C37  value 100nF  [CAP_0805]  (hidden comment: 1276-1003-2-ND)
C38  value 33uF  [CAP_0603]  (hidden comment: C3216X7S0J336M160AC)
C39  value 4.7uF  [CAP_0805]  (hidden comment: CL21A475KAQNNNE)
C40  value 4.7uF  [CAP_0805]  (hidden comment: CL21A475KAQNNNE)
C41  value 1uF  [CAP_0805]  (hidden comment: CL21B105KBFNNNE)
C42  value 100nF  [CAP_0805]  (hidden comment: 1276-1003-2-ND)
C43  value 100nF  [CAP_0805]  (hidden comment: 1276-1003-2-ND)
C44  value 100nF  [CAP_0805]  (hidden comment: 1276-1003-2-ND)
C45  value 4.7uF  [CAP_0805]  (hidden comment: CL21A475KAQNNNE)
C46  value 1uF  [CAP_0805]  (hidden comment: CL21B105KBFNNNE)
J9  64800611622  [64800611622]
LED1  LTST-C171GKT  [LED GREEN 0805]  (value not drawn)
LED2  LTST-C171KRKT  [LED RED 0805]  (value not drawn)
Q5  MMBT3904-7-F  [SOT-23F]  (value not drawn)
R23  value 1K  [RES_0603]  (hidden comment: RC0603FR-071KL)
R24  value 220K  [RES_0603]  (hidden comment: RC0603FR-07220KL)
R25  value 560K  [RES_0603]  (hidden comment: RC0603FR-07560KL)
R26  value 10k  [RES_0603]  (hidden comment: RC0603FR-0710KL)
R27  value 560K  [RES_0603]  (hidden comment: RC0603FR-07560KL)
R28  value 0R  [RES_0603]  (hidden comment: CR160000F)
R29  value 0R  [RES_0603]  (hidden comment: CR160000F)
R30  value 43K  [RES_0603]  (hidden comment: RC0603FR-0743KL)
R31  value 10k  [RES_0603]  (hidden comment: RC0603FR-0710KL)
R32  value 100R  [RES_0603]  (hidden comment: RC0603FR-07100RL)
R33  TFPT1206L1002FM  [PTC_1206]  (value not drawn)
R34  value 1K  [RES_0603]  (hidden comment: RC0603FR-071KL)
R35  value 1K  [RES_0603]  (hidden comment: RC0603FR-071KL)
R36  value 100K  [RES_0603]  (hidden comment: RC0603FR-07100KL)
R37  value 10k  [RES_0603]  (hidden comment: RC0603FR-0710KL)
S1  LHI 878/3902  [LHI 878]  (value not drawn)
U8  NCS36000  [NCS36000]
U9  OPA314AIDBVR  [OPA314]  (value not drawn)

### Blocks framed on the sheet
PIR DETECTOR: C32-C38 C42 C43 LED1 R23-R31 S1 U8
CONNECTORS: C39-C41 J9
TEMPERATURE SENSOR & FILTER: C44-C46 R33 R35-R37 U9
LED DRIVER: LED2 Q5 R32 R34

### Ports
PIR_DETECT

### Nets
3V3DC_SENSOR: C33.2 C34.2 C39.2 C40.2 C41.2 C44.2 J9.1 R23.2 R24.2 R32.2 R33.2 U8.14(VDD) U9.5(V-)
GND_SENSOR: C33.1 C34.1 C37.1 C39.1 C40.1 C41.1 C42.1 C43.1 C44.1 C45.1 C46.1 J9.2 Q5.2(E) R28.1 R29.1 R30.1 R31.1 R37.1 S1.3(GND) U8.7(VSS) U9.2(V+)
LED_SENSOR: J9.3 R34.1
TEMP_ADC: C46.2 J9.4 R36.1
NetC32_1: C32.1 R25.1 R26.2 U8.2(OP2_N)
NetC32_2: C32.2 R25.2 U8.1(OP2_O)
NetC35_1: C35.1 C36.2 R27.2 U8.3(OP1_O)
NetC35_2: C35.2 R26.1
NetC36_1: C36.1 C38.2 R27.1 U8.4(OP1_N)
NetC37_2: C37.2 R24.1 U8.13(OSC)
NetC38_1: C38.1 R31.2
NetC42_2: C42.2 R30.2 S1.2(S) U8.5(OP1_P)
NetC43_2: C43.2 S1.1(D) U8.6(VREF)
NetC45_2: C45.2 R35.2 R36.2
NetJ9_5: J9.5 U8.8(OUT) ; port PIR_DETECT
NetLED1_1: LED1.1 R23.1
NetLED1_2: LED1.2 U8.9(LED)
NetLED2_1: LED2.1 R32.1
NetLED2_2: LED2.2 Q5.3(C)
NetQ5_1: Q5.1(B) R34.2
NetR28_2: R28.2 U8.10(xLED_EN)
NetR29_2: R29.2 U8.12(MODE)
NetR33_1: R33.1 R37.2 U9.3(+IN)
NetR35_1: R35.1 U9.1(OUT) U9.4(-IN)

Not connected (* = marked no-connect by the designer): J9 6; U8 11(NC)*

### Notes on the sheet
- (near R29) AS JUMBER
- (near C45) RC FILTER
- RC FILTER
- Document Name:
- Designed By:
- Department:
- Project Name:
- Sheet Number:
- Size:
- Date:
- (in symbol OPA314AIDBVR) -; +

### Library data of the parts
C32 C36 = CAP CER 10nF 0603: as C10 on sheet Power_Management; Supplier Part Number: 1276-1018-1-ND; Supplier 1: DigiKey; Case Package: 0603; Mounting Type: Surface Mount; Manufacturer Product Number: CL10B102KB8NNNC
C33 C41 C46 = CAP CER 1uF 0805: as C5 on sheet Power_Management; Supplier Part Number: 1276-1029-1-ND; Supplier 1: DigiKey; Case Package: 0805; Mounting Type: Surface Mount; Manufacturer Product Number: CL21B105KBFNNNE
C34 C37 C42-C44 = CAP CER 100nF 0805: as C4 on sheet Power_Management; Supplier Part Number: 1276-1003-2-ND; Supplier 1: DigiKey; Case Package: 0805; Mounting Type: Surface Mount; Manufacturer Product Number: 1276-1003-2-ND
C35 C38 = CAP CER 33uF 1206: CAP CER 33UF 6.3V X7S 1206; Manufacturer: TDK Corporation; Designed By: Emirhan Bozkurt; Supplier Part Number: 445-14814-2-ND; Supplier 1: DigiKey; Case Package: 1206; Mounting Type: Surface Mount; Manufacturer Product Number: C3216X7S0J336M160AC
C39 C40 C45 = CAP CER 4.7uF 0805: as C6 on sheet Power_Management; Supplier Part Number: CL21A475KAQNNNE; Supplier 1: DigiKey; Case Package: 0805; Mounting Type: Surface Mount; Manufacturer Product Number: CL21A475KAQNNNE
J9 = 64800611622-CONN-6P: as J7 on sheet Power_Management; Supplier Part Number: 732-64800611622-ND; Supplier 1: DigiKey; Contact Type: Male
LED1 = LED GREEN: LED GREEN CLEAR SMD; Manufacturer: Lite-On Inc.; Designed By: Emirhan Bozkurt; Supplier Part Number: 160-1423-2-ND; Supplier 1: DigiKey; Color: Green; Manufacturer Product Number: LTST-C171GKT
LED2 = LED RED: LED RED CLEAR SMD; Manufacturer: Lite-On Inc.; Manufacturer Product Number: LTST-C171KRKsT; Designed By: Emirhan Bozkurt; Supplier Part Number: 160-1427-2-ND; Supplier 1: DigiKey; Color: Red
Q5 = MMBT3904-7-F: as Q1 on sheet Power_Management; Supplier Part Number: MMBT3904-FDICT-ND; Supplier 1: DigiKey; ComponentLink1Description: Datasheet; ComponentLink1URL: https://www.digikey.com/en/products/detail/toshiba-semiconductor-and-storage/SSM3K357R-LF/8611159; FET Type: NPN; Voltage - Collector Emitter: 40V; Case Package: SOT-23-3; Manufacturer Product Number: MMBT3904-7-F
R23 R34 R35 = RES 1K 0603: as R2 on sheet Power_Management; Supplier 1: DigiKey; Case Package: 0603; Mounting Type: Surface Mount; Category: Chip Resistor; Manufacturer Product Number: RC0603FR-071KL
R24 = RES 220K 0603: RES 220K OHM 1% 1/10W 0603; Suppier Part Number: 311-220KHRTR-ND; Manufacturer: YAGEO; Designed By: Emirhan Bozkurt; Supplier 1: DigiKey; Case Package: 0603; Mounting Type: Surface Mount; Category: Chip Resistor; Manufacturer Product Number: RC0603FR-07220KL
R25 R27 = RES 560K 0603: RES 1560K 1% 1/10W 0603; Suppier Part Number: 311-560KHRCT-ND; Manufacturer: YAGEO; Designed By: Emirhan Bozkurt; Supplier 1: DigiKey; Case Package: 0603; Mounting Type: Surface Mount; Category: Chip Resistor; Manufacturer Product Number: RC0603FR-07560KL
R26 R31 R37 = RES 10K 0603: as R4 on sheet Power_Management; Supplier 1: DigiKey; Case Package: 0603; Mounting Type: Surface Mount; Category: Chip Resistor; Manufacturer Product Number: RC0603FR-0710KL
R28 R29 = RES 0R 0603: RES 0 OHM 1% 1/10W 0603; Suppier Part Number: 2997-CR160000FTR-ND; Manufacturer: YAGEO; Designed By: Emirhan Bozkurt; Supplier 1: DigiKey; Case Package: 0603; Mounting Type: Surface Mount; Category: Chip Resistor; Manufacturer Product Number: CR160000F
R30 = RES 43K 0603: RES 43K OHM 1% 1/10W 0603; Suppier Part Number: 311-43.0KHRTR-ND; Manufacturer: YAGEO; Designed By: Emirhan Bozkurt; Supplier 1: DigiKey; Case Package: 0603; Mounting Type: Surface Mount; Category: Chip Resistor; Manufacturer Product Number: RC0603FR-0743KL
R32 = RES 100R 0603: as R6 on sheet Microcontroller; Supplier 1: DigiKey; Case Package: 0603; Mounting Type: Surface Mount; Category: Chip Resistor; Manufacturer Product Number: RC0603FR-07100RL
R33 = TFPT1206L1002FM: SENSOR PTC 10KOHM 1% 1206; Designed By: Emirhan Bozkurt; Value: 10k; Supplier Part Number: 541-3533-2-ND; Supplier 1: DigiKey; Case Package: 1206; Min Operating Temperature: -55; Max Operating Temperature: +70; Manufacturer Product Number: TFPT1206L1002FM
R36 = RES 100K 0603: RES 100K OHM 1% 1/10W 0603; Suppier Part Number: 311-100KHRCT-ND; Manufacturer: YAGEO; Designed By: Emirhan Bozkurt; Supplier 1: DigiKey; Case Package: 0603; Mounting Type: Surface Mount; Category: Chip Resistor; Manufacturer Product Number: RC0603FR-07100KL
S1 = LHI 878/3902: SENSOR PYRO DETECTOR DUAL MOTION; Designed By: Emirhan Bozkurt; Max Supply Voltage: 12V; Min Supply Voltage: 2V; Supplier Part Number: 1601-LHI878/3902-ND; Supplier 1: DigiKey; Mounting Type: TH; Manufacturer Product Number: LHI 878/3902
U8 = NCS36000: IC PIR DETECTOR CTLR 14SOIC; Manufacturer: Onsemi; Manufacturer Product Number: NCS36000DRG; Designed By: Emirhan Bozkurt; Supplier Part Number: NCS36000DRGOSCT-ND; Supplier 1: DigiKey; ComponentLink1Description: Datasheet; ComponentLink1URL: https://www.onsemi.com/pdf/datasheet/ncs36000-d.pdf; Case Package: SOIC-14
U9 = OPA314AIDBVR: IC OPAMP GP 1 CIRCUIT SOT23-5; Manufacturer: Texas Instruments; Designed By: Emirhan Bozkurt; Supplier Part Number: 296-36699-1-ND; Supplier 1: DigiKey; Case Package: SOT-23-5 Texas Instruments; Mounting Type: Surface Mount; Manufacturer Product Number: OPA314AIDBVR

## Nets that join several sheets
3V3DC: Power_Management (8 pins), Microcontroller (26 pins)
5VDC: Power_Management (10 pins), Microcontroller (BUZ1.1 C16.2)
GND: Power_Management (33 pins), Microcontroller (35 pins)
LED_DRIVER: Power_Management (J7.3), Microcontroller (U5.21)
NetJ7_5: Power_Management (J7.5), Microcontroller (U5.22)
NetR2_1: Power_Management (R2.1), Microcontroller (U5.41)
NetR3_1: Power_Management (R3.1), Microcontroller (U5.40)
SWCLK: Power_Management (J8.3), Microcontroller (U5.37)
SWDIO: Power_Management (J8.2), Microcontroller (U5.34)
TDI: Power_Management (J8.4), Microcontroller (U5.38)
TEMPERATURE_ADC: Power_Management (J7.4), Microcontroller (U5.19)
USB_N: Power_Management (J6.2), Microcontroller (R13.2 U7.1 U7.6)
USB_P: Power_Management (J6.3), Microcontroller (R16.2 U7.3 U7.4)